# EAGLE design Grove - 3-Axis Digital Gyro v1.2 (EAGLE 6.3)
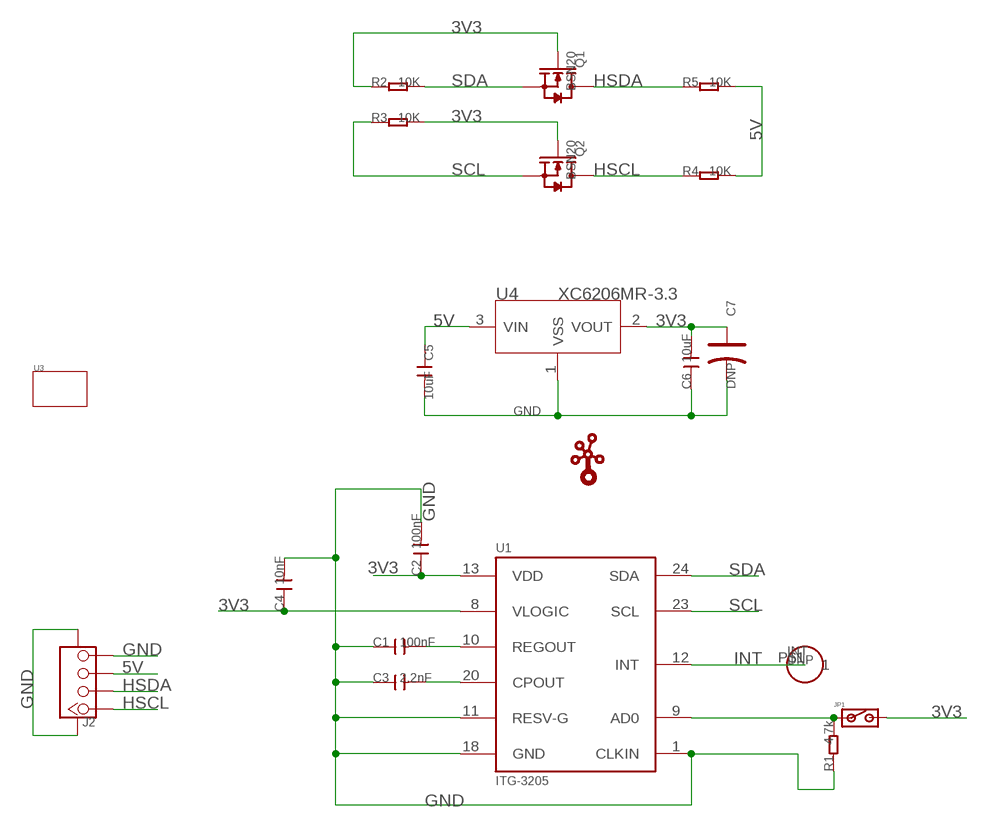
[diagram p0: schematic, sheet 1]

## Parts
C1  100nF  C-0603  [C0603]
C2  100nF  C-0603  [C0603]
C3  2.2nF  C-0603  [C0603]
C4  10nF  C-0603  [C0603]
C5  10uF  C-0805  [C0805]
C6  10uF  C-0805  [C0805]
C7  DNP  CAP-AVX-A  [AVX-A]
INT  DNP  CK_1X132  [CK_1X1]
J2  TWIG-4P-2.0-SMD-FEMALE-REINFORCE'DD'  [4P-SMD-2.0]
JP1  DNP  JP_SW  [JP_SW]
Q1  BSN20  MOSFET-N'SOT23'  [SOT23]
Q2  BSN20  MOSFET-N'SOT23'  [SOT23]
R1  4.7k  R-0603  [R0603]
R2  10K  R-0603  [R0603]
R3  10K  R-0603  [R0603]
R4  10K  R-0603  [R0603]
R5  10K  R-0603  [R0603]
U1  ITG-3205  ITG-3200  [QFN-24]
U3  TWIG'1U'  [1U-DIM-W/-DRILL]
U4  XC6206MR-3.3  XC6206MR  [SOT23]
U$1  TWIGLOGOTWIGLOGO_SMALL  [TWIGLOGO_SMALL]

## Nets
3V3: C2.1 C4.1 C6.2 C7.+ JP1.2 Q1.1(G) Q2.1(G) R2.1 R3.2 U1.8(VLOGIC) U1.13(VDD) U4.2(VOUT)
5V: C5.1 J2.3 R4.2 R5.2 U4.3(VIN)
GND: C1.1 C2.2 C3.1 C4.2 C5.2 C6.1 C7.- J2.4 J2.SS1 J2.SS2 R1.1 U1.1(CLKIN) U1.11(RESV-G) U1.18(GND) U4.1(VSS)
HSCL: J2.1 Q2.3(D) R4.1
HSDA: J2.2 Q1.3(D) R5.1
INT: INT.P$1 U1.12(INT)
N$1: C3.2 U1.20(CPOUT)
N$2: JP1.1 R1.2 U1.9(AD0)
N$3: C1.2 U1.10(REGOUT)
SCL: Q2.2(S) R3.1 U1.23(SCL)
SDA: Q1.2(S) R2.2 U1.24(SDA)

## Library data of the parts
C1-C6 = Discrete:C*: Ceramic Capacitors
C7 = Discrete:CAP*: Electrolytic Capacitors,Tantalum Capacitors and Super Capacitors
INT = CONNECTER1:CK_1X1
J2 = Connector:TWIG-4P-2.0-SMD-FEMALE-REINFORCE
JP1 = CPT_SMD:JP_SW
Q1 Q2 = Discrete:MOSFET-N: IRLL014: http://www.vishay.com/docs/91319/sihll014.pdf
R1-R5 = Discrete:R*
U1 = IC:ITG-3200: ITG-3200 3-axis gyro, digital output, qfn24 package
U3 = moudle:TWIG
U4 = IC:XC6206: LOW ESR Cap.Compatible Positive Voltage Regulators
U$1 = seeedleo:TWIGLOGO

## Net classes
0 default: width 0.203 mm, drill 0.305 mm, clearance 0.203 mm

## Board
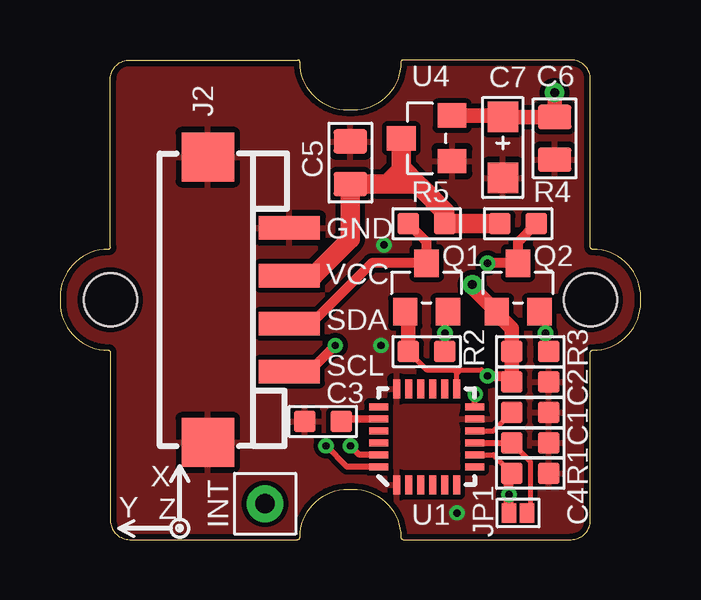
[diagram p1: board, top side]
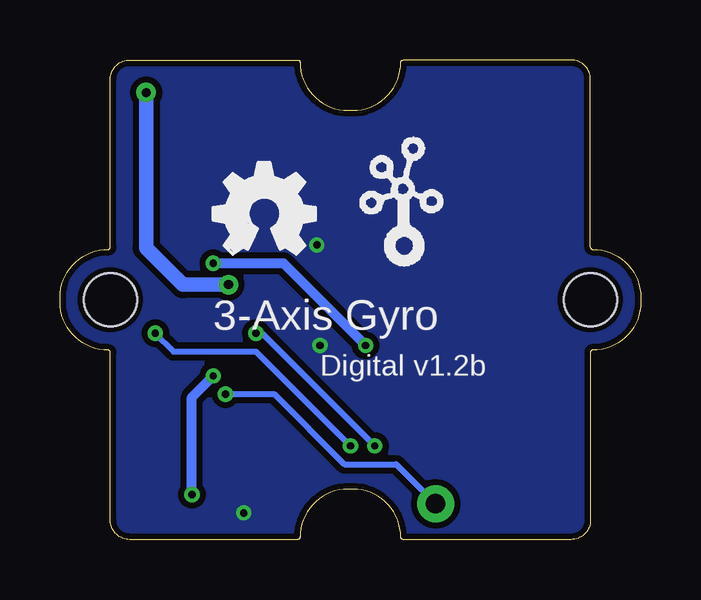
[diagram p2: board, bottom side, seen from below]

Size 24.2 x 20 mm. Coordinates in mm from the lower left corner, seen from the top.
Copper layers (1*16): Top 0.035mm / dielectric 1.5mm / Bottom 0.035mm
Design rules "default": minimum track width 6mil, minimum drill 12mil, track to track 6mil, track to pad 6mil, pad to pad 6mil, via to via 6mil, smd to smd 0mil, copper to edge 10mil, drill to drill 10mil, minimum pad ring 10mil, minimum via ring 6mil, stop-mask expansion 2mil, vias tented up to drill 100mil, thermal gap 10mil

### Footprints (pad centres in the part's own frame; a part is rotated, then mirrored left to right if it is on the bottom)
C0603 = smd 0.889 x 0.889: 1 -0.762,0; 2 0.762,0
C0805 = smd 1.016 x 1.397: 1 -0.889,0; 2 0.889,0
AVX-A = smd 1.27 x 1.27: + -1.27,0; - 1.27,0
CK_1X1 = drill 0.813 pad 1.524: P$1 0,0
4P-SMD-2.0 = smd 0.965 x 2.54: 1 -3,0; 2 -1,0; 3 1,0; 4 3,0 | smd 2.032 x 2.184: SS1 -5.946,3.4; SS2 5.946,3.4
JP_SW = smd 0.813 x 0.61: 1 0,0.381; 2 0,-0.381
SOT23 = smd 1.016 x 1.143: 1 -0.889,-1.016; 2 0.889,-1.016; 3 0,1.016
R0603 = smd 0.889 x 0.889: 1 -0.762,0; 2 0.762,0
QFN-24 = smd 0.8 x 0.3: 1 -2,1.25; 2 -2,0.75; 3 -2,0.25; 4 -2,-0.25; 5 -2,-0.75; 6 -2,-1.25; 13 2,-1.25; 14 2,-0.75; 15 2,-0.25; 16 2,0.25; 17 2,0.75; 18 2,1.25 | smd 0.3 x 0.8: 7 -1.25,-2; 8 -0.75,-2; 9 -0.25,-2; 10 0.25,-2; 11 0.75,-2; 12 1.25,-2; 19 1.25,2; 20 0.75,2; 21 0.25,2; 22 -0.25,2; 23 -0.75,2; 24 -1.25,2
1U-DIM-W/-DRILL = hole 2.2: 0,-10; 0,10
SOT23' = smd 1.016 x 1.2: 1 -0.95,-1.06; 2 0.95,-1.06; 3 0,1.06

### Placement (x,y rotation side)
C1  19.59,5.3 180 top
C2  19.59,6.57 0 top
C3  10.96,4.92 0 top
C4  19.59,2.76 0 top
C5  12.1,15.71 90 top
C6  20.61,16.73 90 top
C7  18.45,16.35 270 top
INT  8.54,1.49 90 top
J2  9.56,10 90 top
JP1  19.09,1.11 270 top
Q1  15.27,10.51 0 top
Q2  19.09,10.51 0 top
R1  19.59,4.03 180 top
R2  15.27,7.84 0 top
R3  19.59,7.84 180 top
R4  19.09,13.18 180 top
R5  15.27,13.18 0 top
U1  15.27,4.29 90 top
U3  12.1,10 90 top
U4  XC6206MR-3.3  [SOT23']  15.27,16.73 90 top
U$1  12.1,11.27 0 bottom
U$2  [OSHW_FILLX150_NOTEXT]  17.81,11.9 0 bottom

### Tracks (layer width: path | path; a pad name or v marks a point on that pad's centre or on a via)
3V3  (via drill 0.3 pad 0.64, 0.38 pad 0.81)
  Top 0.203: R2.1 15.27,7.08 16.42,7.08 | 16.42,7.08 16.55,7.08 | 16.55,7.08 16.67,7.08 | 16.67,7.08 17.56,7.08 v17.81,6.83 | U1.13 16.52,6.93 | 16.52,6.93 16.52,7.06 16.55,7.08 | Q1.1 14.39,9.43 14.51,9.3 | U1.8 18.06,3.54 C4.1 | 16.52,6.93 16.55,6.95 | 16.55,6.95 16.67,7.08 | 16.42,7.08 16.55,6.95
  Top 0.254: 18.55,6.29 C2.1 | U1.13 16.55,6.32
  Top 0.406: JP1.2 v18.7,1.87 18.7,2.63 C4.1 | v17.81,6.83 18.58,6.83 C2.1
  Top 0.61: U4.2 18.39,17.68 C7.+ C6.2 v20.61,18.64 | R2.1 14.51,9.3 | C2.1 R3.2 18.83,8.8 18.2,9.43 Q2.1 17.18,10.51 v17.18,10.63
  Bottom 0.406: v18.7,1.87 18.7,5.94 v17.81,6.83
  Bottom 0.61: v20.61,18.64 20.61,12.16 19.09,10.63 v17.18,10.63
5V
  Top 0.813: J2.3 9.58,11.02 10.58,11.02 12.1,12.54 C5.1 13.62,14.83 | R4.2 R5.2 16.04,13.68 15.02,14.7 14.89,14.83 | 13.62,14.83 14.39,14.83 | 14.39,14.83 14.89,14.83 | U4.3 14.21,15.6 14.21,15.5 | 14.21,15.42 14.21,15 14.39,14.83 | 14.21,15.5 14.21,15.42 | 14.21,15.42 13.62,14.83 | 14.21,15.5 14.89,14.83
GND  (via drill 0.3 pad 0.64)
  other vias: 13.5,12.29 13.37,8.1 16.55,1.11
  pour Bottom (isolate 0.254): -0.6,-0.16 24.8,-0.16 24.8,20.16 -0.6,20.16 -0.6,-0.03
  pour Top (isolate 0.203): -0.6,-0.16 24.8,-0.16 24.8,20.16 -0.6,20.16 -0.6,-0.03
HSCL  (via drill 0.3 pad 0.64)
  Top 0.406: R4.1 19.09,12.41 Q2.3 v17.81,11.52 | v11.46,8.1 10.32,6.95 9.61,6.95 J2.1
  Bottom 0.406: v17.81,11.52 14.89,11.52 v11.46,8.1
HSDA
  Top 0.406: 10.45,8.98 12.99,11.52 Q1.3 15.27,12.41 R5.1
  Top 0.61: 10.45,8.98 9.58,8.98 J2.2
INT  (via drill 0.3 pad 0.64)
  Top 0.254: U1.12 17.27,6.03 v17.31,6.06
  Bottom 0.254: v17.31,6.06 15.27,6.06 12.35,3.14 10.2,3.14 INT.P$1
N$1
  Top 0.305: U1.20 11.85,5.04 11.48,5.04
  Top 0.61: C3.2 11.85,5.04
N$2
  Top 0.203: R1.2 19.59,3.27 19.59,1.24 JP1.1
  Top 0.254: U1.9 R1.2
N$3
  Top 0.203: U1.10 18.06,4.54 C1.2
SCL  (via drill 0.3 pad 0.64)
  Top 0.254: R3.1 20.23,7.97 v20.23,8.6 20.23,9.24 Q2.2 | U1.23 12.47,3.54 v12.1,3.9
  Bottom 0.254: v20.23,8.6 19.47,7.84 16.04,7.84 v12.1,3.9
SDA  (via drill 0.3 pad 0.64)
  Top 0.254: R2.2 v16.04,8.6 16.04,9.37 | U1.24 11.95,3.04 v11.08,3.9
  Top 0.61: Q1.2 16.04,9.37
  Bottom 0.254: v16.04,8.6 15.78,8.6 v11.08,3.9

### Text on the board
tPlace: GND | VCC | SDA | SCL
bPlace: 3-Axis Gyro | Digital v1.2b
tNames: X | Y | Z